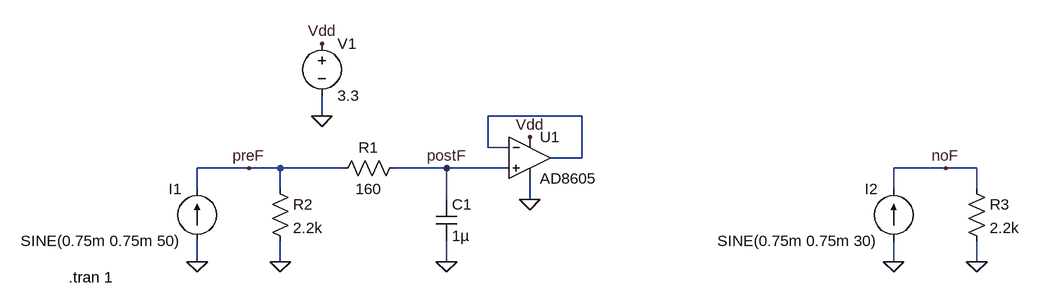
[diagram p0: schematic LowPass_Buff.asc]
LowPass_Buff.asc, the LTspice schematic file:
Version 4
SHEET 1 1016 680
WIRE -64 16 -64 -16
WIRE 336 16 192 16
WIRE 192 64 192 16
WIRE 224 64 192 64
WIRE 336 80 336 16
WIRE 336 80 288 80
WIRE -176 96 -256 96
WIRE -128 96 -176 96
WIRE -32 96 -128 96
WIRE 128 96 48 96
WIRE 224 96 128 96
WIRE 896 96 816 96
WIRE 944 96 896 96
WIRE -256 128 -256 96
WIRE -128 128 -128 96
WIRE 816 128 816 96
WIRE 944 128 944 96
WIRE 128 144 128 96
WIRE 256 144 256 112
WIRE -256 240 -256 208
WIRE -128 240 -128 208
WIRE 128 240 128 208
WIRE 816 240 816 208
WIRE 944 240 944 208
FLAG -256 240 0
FLAG 128 240 0
FLAG -128 240 0
FLAG 816 240 0
FLAG 944 240 0
FLAG -176 96 preF
FLAG 128 96 postF
FLAG 896 96 noF
FLAG 256 144 0
FLAG -64 16 0
FLAG -64 -96 Vdd
FLAG 256 48 Vdd
SYMBOL current -256 208 R180
WINDOW 0 24 80 Left 2
WINDOW 3 24 0 Left 2
WINDOW 123 0 0 Left 0
WINDOW 39 0 0 Left 0
SYMATTR InstName I1
SYMATTR Value SINE(0.75m 0.75m 50)
SYMBOL res 64 80 R90
WINDOW 0 0 56 VBottom 2
WINDOW 3 32 56 VTop 2
SYMATTR InstName R1
SYMATTR Value 160
SYMBOL cap 112 144 R0
SYMATTR InstName C1
SYMATTR Value 1µ
SYMBOL res -144 112 R0
SYMATTR InstName R2
SYMATTR Value 2.2k
SYMBOL current 816 208 R180
WINDOW 0 24 80 Left 2
WINDOW 3 24 0 Left 2
WINDOW 123 0 0 Left 0
WINDOW 39 0 0 Left 0
SYMATTR InstName I2
SYMATTR Value SINE(0.75m 0.75m 30)
SYMBOL res 928 112 R0
SYMATTR InstName R3
SYMATTR Value 2.2k
SYMBOL OpAmps\\AD8605 256 16 R0
SYMATTR InstName U1
SYMBOL voltage -64 -112 R0
WINDOW 123 0 0 Left 0
WINDOW 39 0 0 Left 0
SYMATTR InstName V1
SYMATTR Value 3.3
TEXT -454 264 Left 2 !.tran 1

The netlist it stands for:
* LowPass_Buff.asc
I1 0 preF SINE(0.75m 0.75m 50)
R1 postF preF 160
C1 postF 0 1µ
R2 preF 0 2.2k
I2 0 noF SINE(0.75m 0.75m 30)
R3 noF 0 2.2k
XU1 postF N001 Vdd 0 N001 AD8605  ; pins In+ In- V+ V- OUT
V1 Vdd 0 3.3
.tran 1
.lib ADI.lib
.backanno
.end